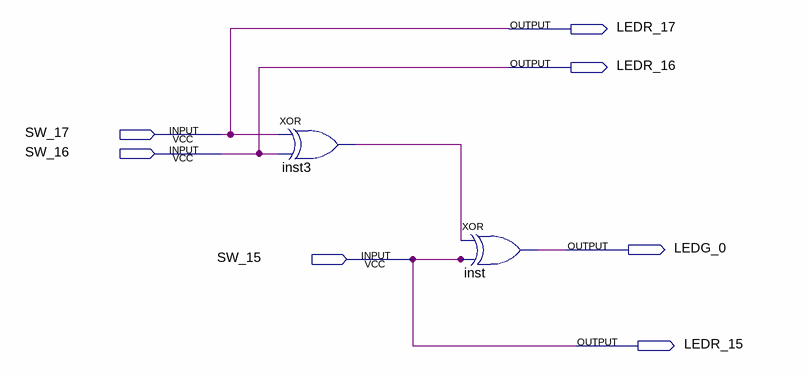
[diagram p0: schematic sheet]
// Quartus schematic test.bdf as structural Verilog: 2 symbols, 7 pins
module test (
  input  SW_17,
  input  SW_16,
  input  SW_15,
  output LEDR_17,
  output LEDR_16,
  output LEDG_0,
  output LEDR_15
);

  wire inst3_out;

  xor inst3 (inst3_out, SW_17, SW_16);
  xor inst (LEDG_0, inst3_out, SW_15);

  assign LEDR_15 = SW_15;
  assign LEDR_16 = SW_16;
  assign LEDR_17 = SW_17;
endmodule
